# Altium schematic sheet МПСУ-46342.21-004 Э3 Лист7.SchDoc
size 297 x 209 mm; Address1: Address1; Address2: Address2; Address3: Address3; Address4: Address4; SheetNumber: 1; DocumentTypeSCH: Э3
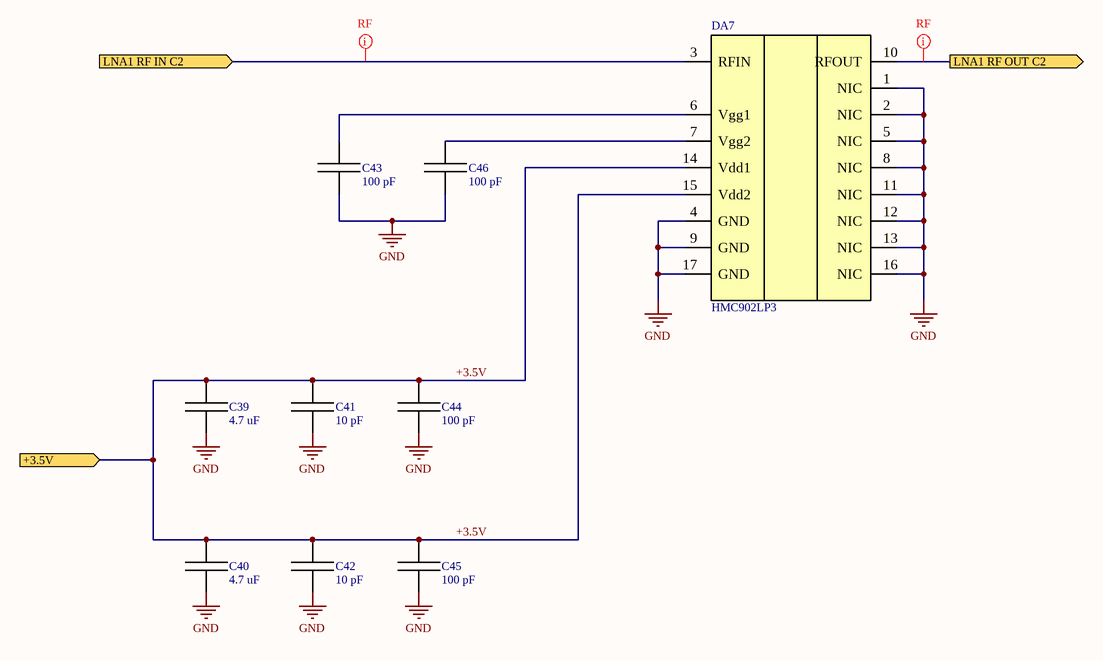
[diagram p0: МПСУ-46342.21-004 Э3 Лист7.SchDoc]

## Parts
C39  4.7 uF  [CAPC160X80X90L30N]
C40  4.7 uF  [CAPC160X80X90L30N]
C41  10 pF  [CAPC100X50X55L20N]
C42  10 pF  [CAPC100X50X55L20N]
C43  100 pF  [CAPC100X50X55L20N]
C44  100 pF  [CAPC100X50X55L20N]
C45  100 pF  [CAPC100X50X55L20N]
C46  100 pF  [CAPC100X50X55L20N]
DA7  HMC902LP3  [QFN17P50_300X300X90L40X25T170N]

## Ports
+3.5V (in), LNA1 RF IN C2 (in), LNA1 RF OUT C2 (out)

## Nets
GND: C39.1 C40.1 C41.1 C42.1 C43.1 C44.1 C45.1 C46.1 DA7.1(NIC) DA7.2(NIC) DA7.4(GND) DA7.5(NIC) DA7.8(NIC) DA7.9(GND) DA7.11(NIC) DA7.12(NIC) DA7.13(NIC) DA7.16(NIC) DA7.17(GND)
+3.5V: C39.2 C40.2 C41.2 C42.2 C44.2 C45.2 DA7.14(Vdd1) DA7.15(Vdd2) ; port +3.5V
LNA1 RF IN C2: DA7.3(RFIN) ; port LNA1 RF IN C2
LNA1 RF OUT C2: DA7.10(RFOUT) ; port LNA1 RF OUT C2
NetC43_2: C43.2 DA7.6(Vgg1)
NetC46_2: C46.2 DA7.7(Vgg2)

## Layout directives
net class RF: LNA1 RF IN C2, LNA1 RF OUT C2

## Notes on the sheet
- Подп. и дата
- Инв. № дубл.
- Взам. инв. №
- Инв. № подл.
- Изм.
- Лист
- № докум.
- Подп.
- Дата
- Копировал
- Формат А4

## Library data of the parts
C39 C40 C43-C46 = Capacitor: Capacitor, generic; Tolerance: 5 %; VDC: 20 V; PartNumber: *; Dielectric: *; Manufacturer: *
  C39: Value: 4.7 uF; Package: 0603
  C40: Value: 4.7 uF; Package: 0402
  C43-C46: Value: 100 pF; Package: 0402
C41 C42 = Capacitor: Capacitor, generic; Value: 0.01 nF; Tolerance: 5 %; VDC: 20 V; PartNumber: *; Dielectric: *; Manufacturer: *; Package: 0402
DA7 = HMC902LP3: GaAs, pHEMT, MMIC, Low Noise Amplifier, 5 GHz to 11 GHz; Manufacturer: Analog Devices; ComponentLink1Description: Component page; ComponentLink1URL: https://www.analog.com/en/products/hmc902lp3e.html; PartNumber: HMC902LP3; ClassName: RFCons